# Altium schematic sheet CMOS_MUX.SchDoc
size A4; ApprovedBy: Mateusz Kowalik; CheckedBy: Mateusz Kowalik; Author: Mateusz Kowalik; CompanyName: InMotion Labs sp. z o.o.; DrawnBy: Mateusz Kowalik; Engineer: Mateusz Kowalik; Organization: InMotion Labs sp. z o.o.; Address1: Rydlówka 5A; Address2: 30-363 Kraków; Address4: Poland; DocumentNumber: 13; Revision: Rev 0; SheetNumber: 13; SheetTotal: 17
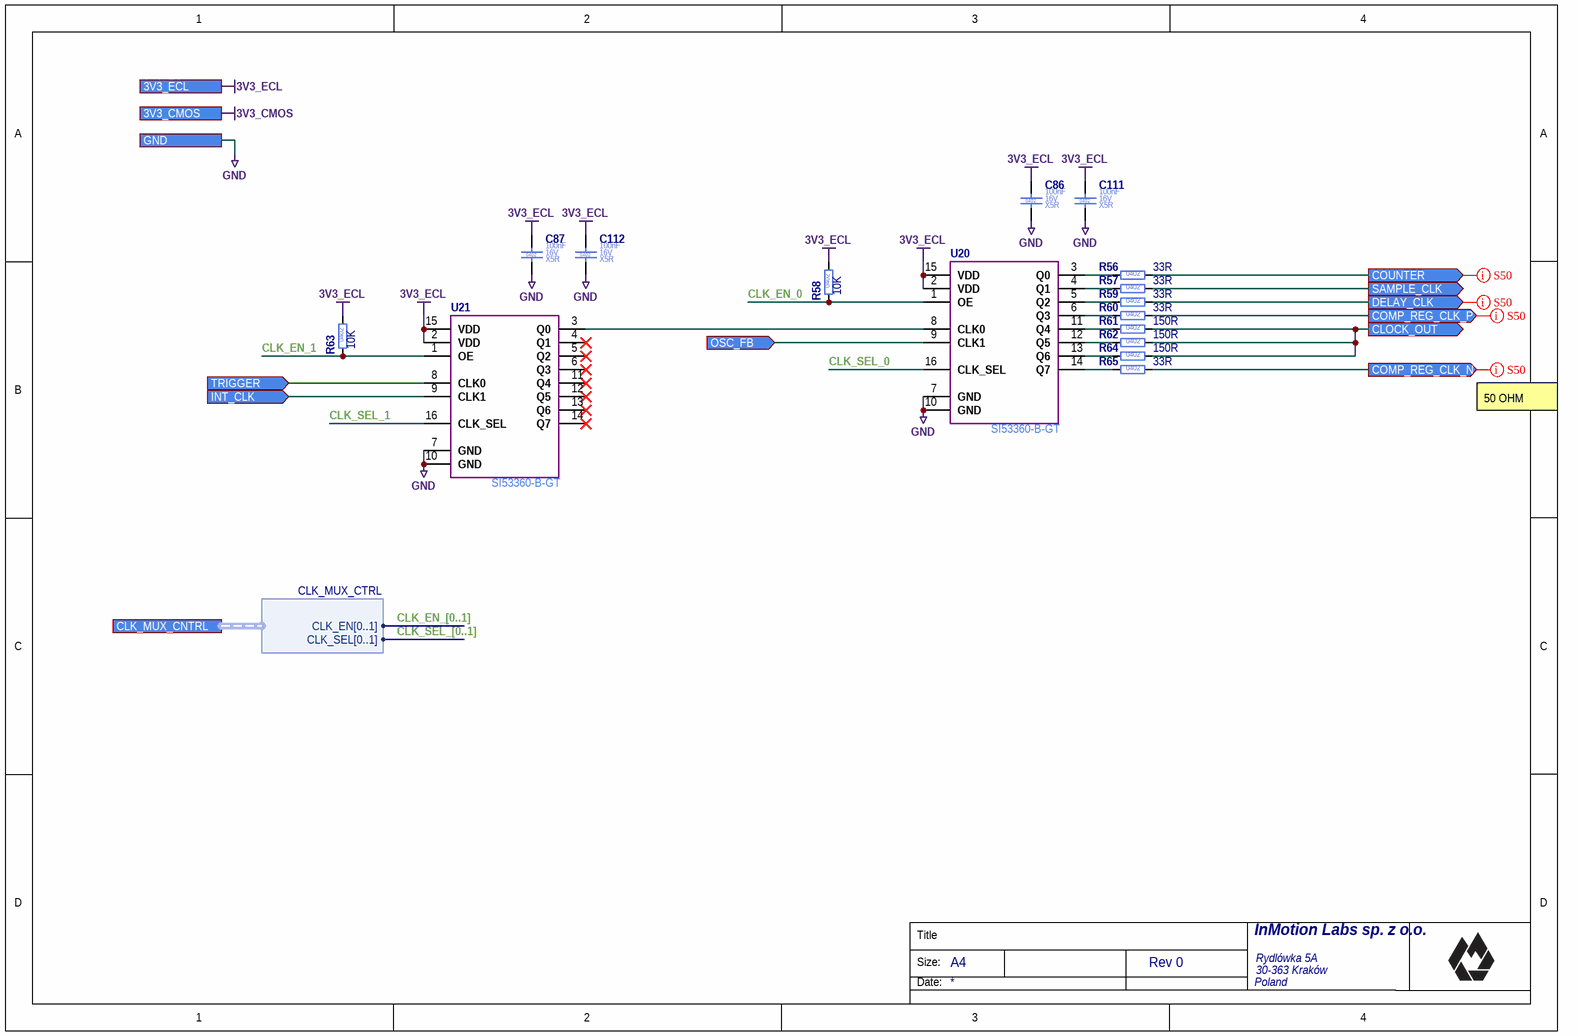
[diagram p0: CMOS_MUX.SchDoc]

## Parts
C86  Case/Package: 0402  Voltage Rating (DC): 16V  Dielectric: X5R  Capacitance: 100nF  [C_0402_1005]  (hidden comment: C_100NF_16V_X5R_0402_10)
C87  Case/Package: 0402  Voltage Rating (DC): 16V  Dielectric: X5R  Capacitance: 100nF  [C_0402_1005]  (hidden comment: C_100NF_16V_X5R_0402_10)
C111  Case/Package: 0402  Voltage Rating (DC): 16V  Dielectric: X5R  Capacitance: 100nF  [C_0402_1005]  (hidden comment: C_100NF_16V_X5R_0402_10)
C112  Case/Package: 0402  Voltage Rating (DC): 16V  Dielectric: X5R  Capacitance: 100nF  [C_0402_1005]  (hidden comment: C_100NF_16V_X5R_0402_10)
R56  Resistance: 33R  Case/Package: 0402  [R_0402_1005]  (hidden comment: R_33R_0402_1)
R57  Resistance: 33R  Case/Package: 0402  [R_0402_1005]  (hidden comment: R_33R_0402_1)
R58  Resistance: 10K  Case/Package: 0402  [R_0402_1005]  (hidden comment: R_10K_0402_1)
R59  Resistance: 33R  Case/Package: 0402  [R_0402_1005]  (hidden comment: R_33R_0402_1)
R60  Resistance: 33R  Case/Package: 0402  [R_0402_1005]  (hidden comment: R_33R_0402_1)
R61  Resistance: 150R  Case/Package: 0402  [R_0402_1005]  (hidden comment: R_150R_0402_1)
R62  Resistance: 150R  Case/Package: 0402  [R_0402_1005]  (hidden comment: R_150R_0402_1)
R63  Resistance: 10K  Case/Package: 0402  [R_0402_1005]  (hidden comment: R_10K_0402_1)
R64  Resistance: 150R  Case/Package: 0402  [R_0402_1005]  (hidden comment: R_150R_0402_1)
R65  Resistance: 33R  Case/Package: 0402  [R_0402_1005]  (hidden comment: R_33R_0402_1)
U20  Si53360-B-GT  [TSOP65P640X120-16N]
U21  Si53360-B-GT  [TSOP65P640X120-16N]

## Ports
3V3_CMOS, 3V3_ECL, CLK_MUX_CNTRL (harness CLK_MUX_CTRL), CLOCK_OUT (out), COMP_REG_CLK_N (out), COMP_REG_CLK_P (out), COUNTER (out), DELAY_CLK (out), GND, INT_CLK (in), OSC_FB (in), SAMPLE_CLK (out), TRIGGER (in)

## Harnesses
CLK_MUX_CTRL: CLK_SEL[0..1], CLK_EN[0..1]

## Nets
3V3_CMOS: port 3V3_CMOS
3V3_ECL: C86.1 C87.1 C111.1 C112.1 R58.2 R63.2 U20.2(VDD) U20.15(VDD) U21.2(VDD) U21.15(VDD) ; port 3V3_ECL
GND: C86.2 C87.2 C111.2 C112.2 U20.7(GND) U20.10(GND) U21.7(GND) U21.10(GND) ; port GND
CLK_EN_0: R58.1 U20.1(OE)
CLK_EN_1: R63.1 U21.1(OE)
CLK_SEL_0: U20.16(CLK_SEL)
CLK_SEL_1: U21.16(CLK_SEL)
CLOCK_OUT: R61.2 R62.2 R64.2 ; port CLOCK_OUT
COMP_REG_CLK_N: R65.2 ; port COMP_REG_CLK_N
COMP_REG_CLK_P: R60.2 ; port COMP_REG_CLK_P
COUNTER: R56.2 ; port COUNTER
DELAY_CLK: R59.2 ; port DELAY_CLK
INT_CLK: U21.9(CLK1) ; port INT_CLK
OSC_FB: U20.9(CLK1) ; port OSC_FB
SAMPLE_CLK: R57.2 ; port SAMPLE_CLK
TRIGGER: U21.8(CLK0) ; port TRIGGER
NetR56_1: R56.1 U20.3(Q0)
NetR57_1: R57.1 U20.4(Q1)
NetR59_1: R59.1 U20.5(Q2)
NetR60_1: R60.1 U20.6(Q3)
NetR61_1: R61.1 U20.11(Q4)
NetR62_1: R62.1 U20.12(Q5)
NetR64_1: R64.1 U20.13(Q6)
NetR65_1: R65.1 U20.14(Q7)
NetU20_8: U20.8(CLK0) U21.3(Q0)

Not connected (* = marked no-connect by the designer): U21 4(Q1)* 5(Q2)* 6(Q3)* 11(Q4)* 12(Q5)* 13(Q6)* 14(Q7)*

## Buses and harness runs
bus CLK_EN_[0..1]
bus CLK_SEL_[0..1]

## Layout directives
net class S50: COMP_REG_CLK_N, COMP_REG_CLK_P, COUNTER, DELAY_CLK

## Notes on the sheet
- 50 OHM
- Title
- Size:
- Date:
- A4

## Library data of the parts
C86 C87 C111 C112 = C_100NF_16V_X5R_0402_10: Ceramic Capacitor; Manufacturer Part Number: EMK105BJ104KV-F; Manufacturer: Taiyo Yuden; Value: 100nF; Tolerance: 10%; Part Number: C_100NF_16V_X5R_0402_10; Mount: Surface Mount; Height: 500um; HelpURL: http://datasheet.octopart.com/EMK105BJ104KV-F-Taiyo-Yuden-datasheet-8857305.pdf; RoHS: Compliant; Max Operating Temperature: 125°C; Status: MK; Supplier 1: Mouser; Supplier Part Number 1: 963-EMK105BJ104KV-F; Manufacturer 2: Samsung Electro-Mechanics; Manufacturer Part Number 2: CL05B104KO5NNNC; Supplier 2: LCSC; Supplier Part Number 2: C1525
R56 R57 R59 R60 R65 = R_33R_0402_1: Thick Film Resistor; Manufacturer: Yageo; Manufacturer Part Number: RC0402FR-0733RL; Value: 33R; Tolerance: 1%; Voltage Rating (DC): 50V; Power Rating: 63mW; Stats: MK; Part Number: R_33R_0402_1; Mount: Surface Mount; Height: 350um; HelpURL: https://pl.mouser.com/datasheet/2/447/PYu-RC_Group_51_RoHS_L_10-1527934.pdf; RoHS: Compliant; Max Operating Temperature: 155°C; Supplier 1: Mouser; Supplier Part Number 1: 603-RC0402FR-0733RL; Manufacturer 2: Uniroyal Elec; Manufacturer Part Number 2: 0402WGF330JTCE; Supplier 2: LCSC; Supplier Part Number 2: C25105
R58 R63 = R_10K_0402_1: Thick Film Resistor; Manufacturer: Yageo; Manufacturer Part Number: RC0402FR-7W10KL; Value: 10K; Tolerance: 1%; Voltage Rating (DC): 50V; Power Rating: 63mW; Stats: MK; Part Number: R_10K_0402_1; Mount: Surface Mount; Height: 350um; HelpURL: https://pl.mouser.com/datasheet/2/447/PYu-RC_Group_51_RoHS_L_10-1664068.pdf; RoHS: Compliant; Max Operating Temperature: 155°C; Supplier 1: Mouser; Supplier Part Number 1: 603-RC0402FR-7W10KL; Manufacturer 2: Uniroyal Elec; Manufacturer Part Number 2: 0402WGF1002TCE; Supplier 2: LCSC; Supplier Part Number 2: C25744
R61 R62 R64 = R_150R_0402_1: Thick Film Resistor; Manufacturer: Yageo; Manufacturer Part Number: RC0402FR-07150RL; Value: 150R; Tolerance: 1%; Voltage Rating (DC): 50V; Power Rating: 63mW; Stats: MK; Part Number: R_150R_0402_1; Mount: Surface Mount; Height: 350um; HelpURL: http://datasheet.octopart.com/RC0402FR-07150RL-Yageo-datasheet-10408619.pdf; RoHS: Compliant; Max Operating Temperature: 155°C; Supplier 1: Mouser; Supplier Part Number 1: 603-RC0402FR-07150RL; Manufacturer 2: Uniroyal Elec; Manufacturer Part Number 2: 0402WGF1500TCE; Supplier 2: LCSC; Supplier Part Number 2: C25082
U20 U21 = Si53360-B-GT: Low Jitter Clock Buffer; Manufacturer: Silicon Labs; Max Frequency: 200MHz; Max Supply Voltage: 3.6V; Min Supply Voltage: 2.25V; Part Number: Si53360-B-GT; Case/Package: TSSOP16; Mount: Surface Mount; Height: 1.2mm; HelpURL: https://pl.mouser.com/datasheet/2/368/Si5336x-datasheet-1397964.pdf; Logic Function: Clock Buffer; Marking: Si53360; Max Operating Temperature: 85°C; RoHS: Compliant; Status: MK; Manufacturer Part Number: SI53360-B-GT; Supplier 1: Mouser; Supplier Part Number 1: 634-SI53360-B-GT